# EAGLE design Dimmer_RevA (EAGLE 7.4.0)
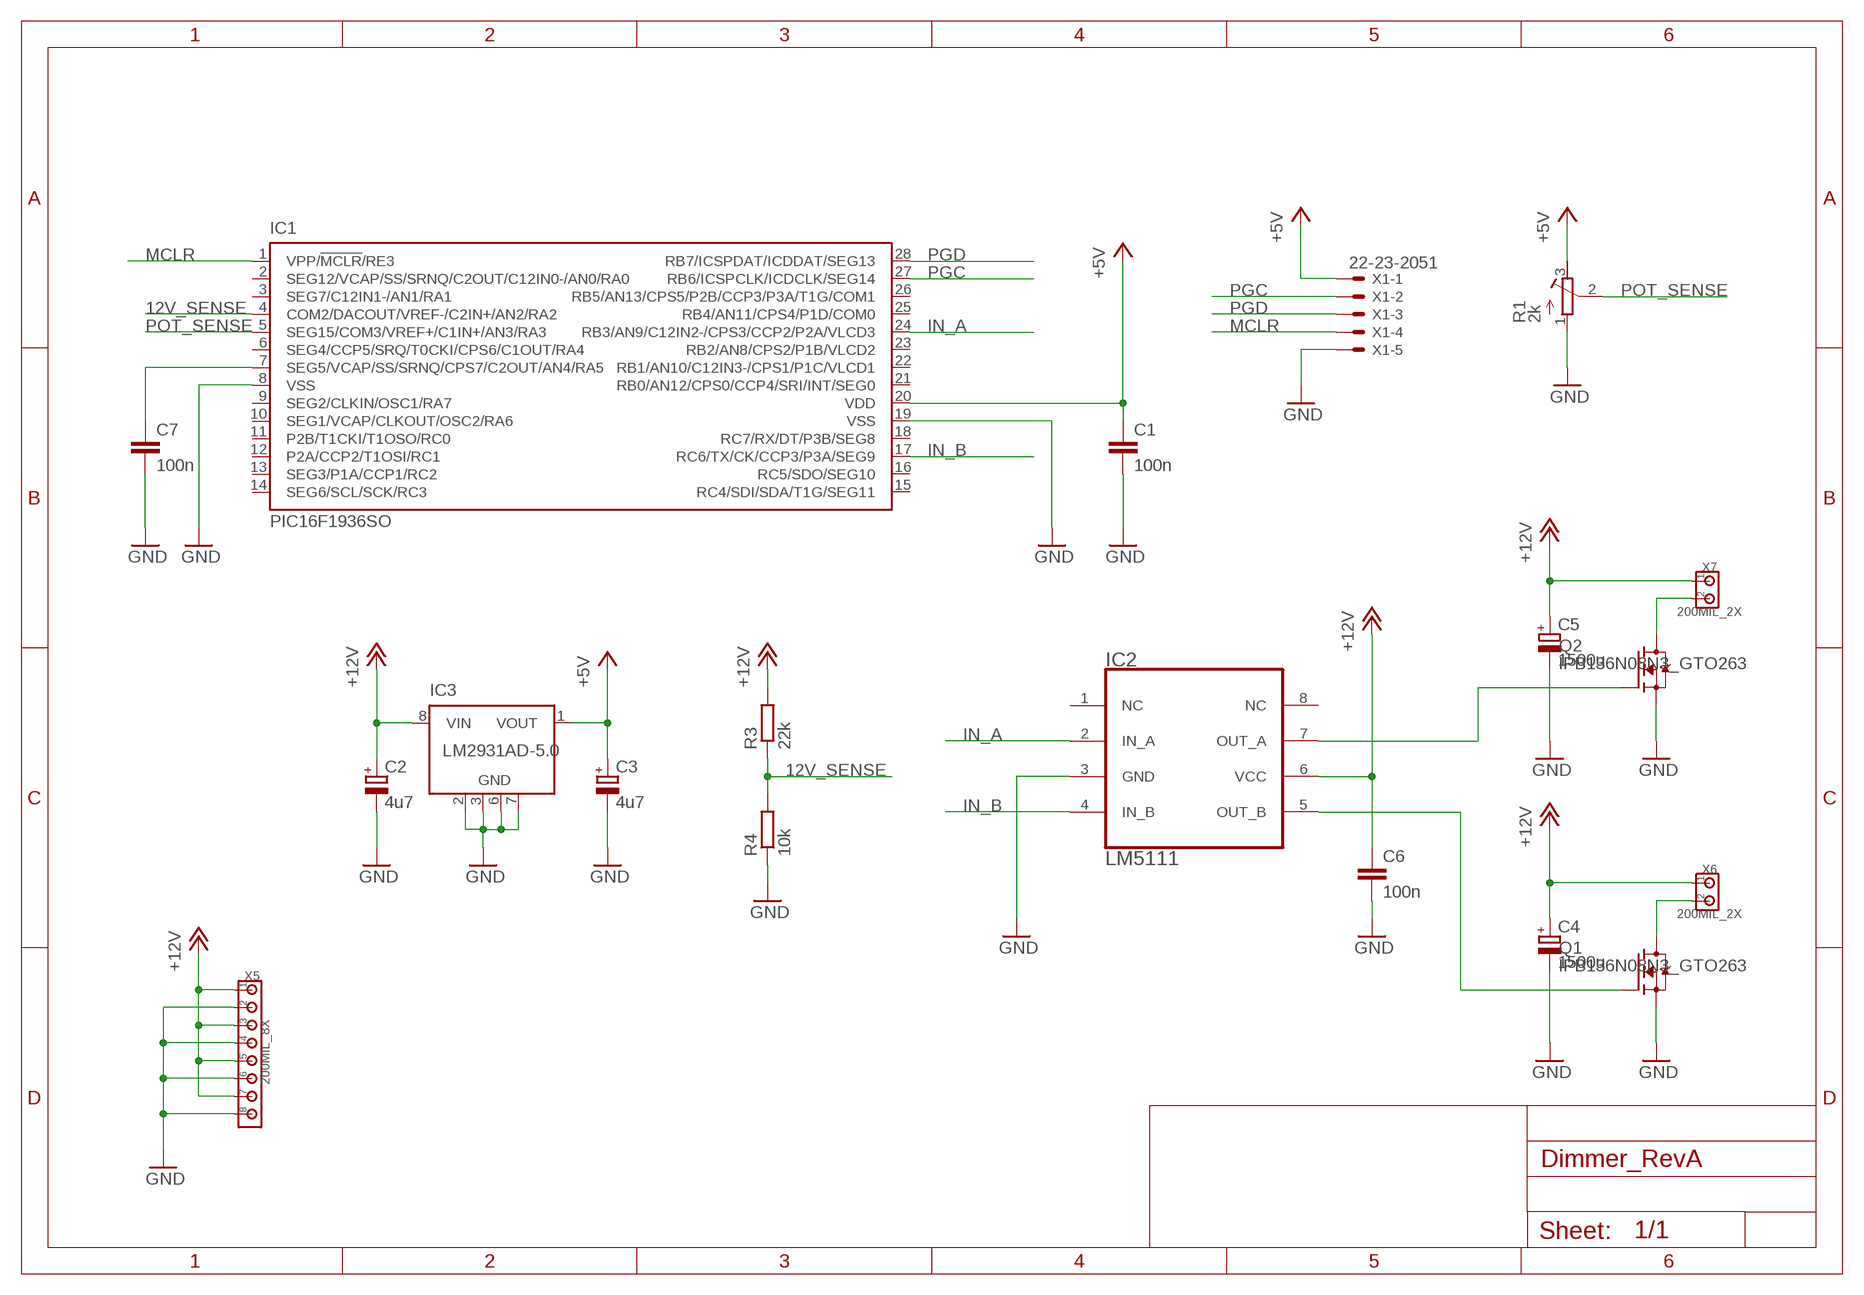
[diagram p0: schematic, sheet 1]

## Parts
C1  100n  CC0805  [C0805]
C2  4u7  C_POLARIZEDSMC_C  [SMC_C]
C3  4u7  C_POLARIZEDSMC_C  [SMC_C]
C4  1500u  C_POLARIZED10MM  [10MM]
C5  1500u  C_POLARIZED10MM  [10MM]
C6  100n  CC0805  [C0805]
C7  100n  CC0805  [C0805]
IC1  PIC16F1936SO  [SO28W]
IC2  LM5111  [SOIC8]
IC3  LM2931AD-5.0  [SO8]
Q1  IPB136N08N3_GTO263  [TO263-3]
Q2  IPB136N08N3_GTO263  [TO263-3]
R1  2k  TRIMMER  [CONTELEC]
R3  22k  RESISTORR0805  [R0805]
R4  10k  RESISTORR0805  [R0805]
X1  22-23-2051  [22-23-2051]
X5  200MIL_8X  [200MIL_8X]
X6  200MIL_2X  [200MIL_2X]
X7  200MIL_2X  [200MIL_2X]

## Nets
12V_SENSE: IC1.4(COM2/DACOUT/VREF-/C2IN+/AN2/RA2) R3.1 R4.2
+5V: C1.1 C3.+ IC1.20(VDD) IC3.1(VOUT) R1.3(CW) X1.1
+12V: C2.+ C4.+ C5.+ C6.1 IC2.6(VCC) IC3.8(VIN) R3.2 X5.1 X5.3 X5.5 X5.7 X6.1 X7.1
GND: C1.2 C2.- C3.- C4.- C5.- C6.2 C7.2 IC1.8(VSS) IC1.19(VSS) IC2.3(GND) IC3.2(GND) IC3.3(GND) IC3.6(GND) IC3.7(GND) Q1.3(S) Q2.3(S) R1.1(CCW) R4.1 X1.5 X5.2 X5.4 X5.6 X5.8
IN_A: IC1.24(RB3/AN9/C12IN2-/CPS3/CCP2/P2A/VLCD3) IC2.2(IN_A)
IN_B: IC1.17(RC6/TX/CK/CCP3/P3A/SEG9) IC2.4(IN_B)
MCLR: IC1.1(VPP/!MCLR!/RE3) X1.4
N$1: IC2.5(OUT_B) Q1.1(G)
N$2: Q1.TAB(D) X6.2
N$4: Q2.TAB(D) X7.2
N$5: C7.1 IC1.7(SEG5/VCAP/SS/SRNQ/CPS7/C2OUT/AN4/RA5)
N$6: IC2.7(OUT_A) Q2.1(G)
PGC: IC1.27(RB6/ICSPCLK/ICDCLK/SEG14) X1.2
PGD: IC1.28(RB7/ICSPDAT/ICDDAT/SEG13) X1.3
POT_SENSE: IC1.5(SEG15/COM3/VREF+/C1IN+/AN3/RA3) R1.2(WIPER)
Unconnected: IC1.2(SEG12/VCAP/SS/SRNQ/C2OUT/C12IN0-/AN0/RA0) IC1.3(SEG7/C12IN1-/AN1/RA1) IC1.6(SEG4/CCP5/SRQ/T0CKI/CPS6/C1OUT/RA4) IC1.9(SEG2/CLKIN/OSC1/RA7) IC1.10(SEG1/VCAP/CLKOUT/OSC2/RA6) IC1.11(P2B/T1CKI/T1OSO/RC0) IC1.12(P2A/CCP2/T1OSI/RC1) IC1.13(SEG3/P1A/CCP1/RC2) IC1.14(SEG6/SCL/SCK/RC3) IC1.15(RC4/SDI/SDA/T1G/SEG11) IC1.16(RC5/SDO/SEG10) IC1.18(RC7/RX/DT/P3B/SEG8) IC1.21(RB0/AN12/CPS0/CCP4/SRI/INT/SEG0) IC1.22(RB1/AN10/C12IN3-/CPS1/P1C/VLCD1) IC1.23(RB2/AN8/CPS2/P1B/VLCD2) IC1.25(RB4/AN11/CPS4/P1D/COM0) IC1.26(RB5/AN13/CPS5/P2B/CCP3/P3A/T1G/COM1) IC2.1(NC)

## Power pins joined to a net without a drawn wire
NC: IC2.8(NC)

## Library data of the parts
C1 C6 C7 = 00Capacitor:C: Capacitor
C2-C5 = 00Capacitor:C_POLARIZED
IC1 = 00PIC:PIC16F19*: Flash-Based, 8-Bit CMOS Microcontroller; EEPROM: 256; FLASH: 8192; RAM: 512
IC2 = 00Logic:LM5111
IC3 = 00VoltageRegulator:LM2931*
Q1 Q2 = 00Mosfet:IPB136N08N3_G
R1 = 00Resistor:TRIMMER
R3 R4 = 00Resistor:RESISTOR: RESISTOR, European symbol
X1 = 00Connector:22-23-2051: .100" (2.54mm) Center Header - 5 Pin; MF: MOLEX; MPN: 22-23-2051; OC_FARNELL: 1462952; OC_NEWARK: 38C9178
X5 = 00Connector:200MIL_8X
X6 X7 = 00Connector:200MIL_2X

## Board
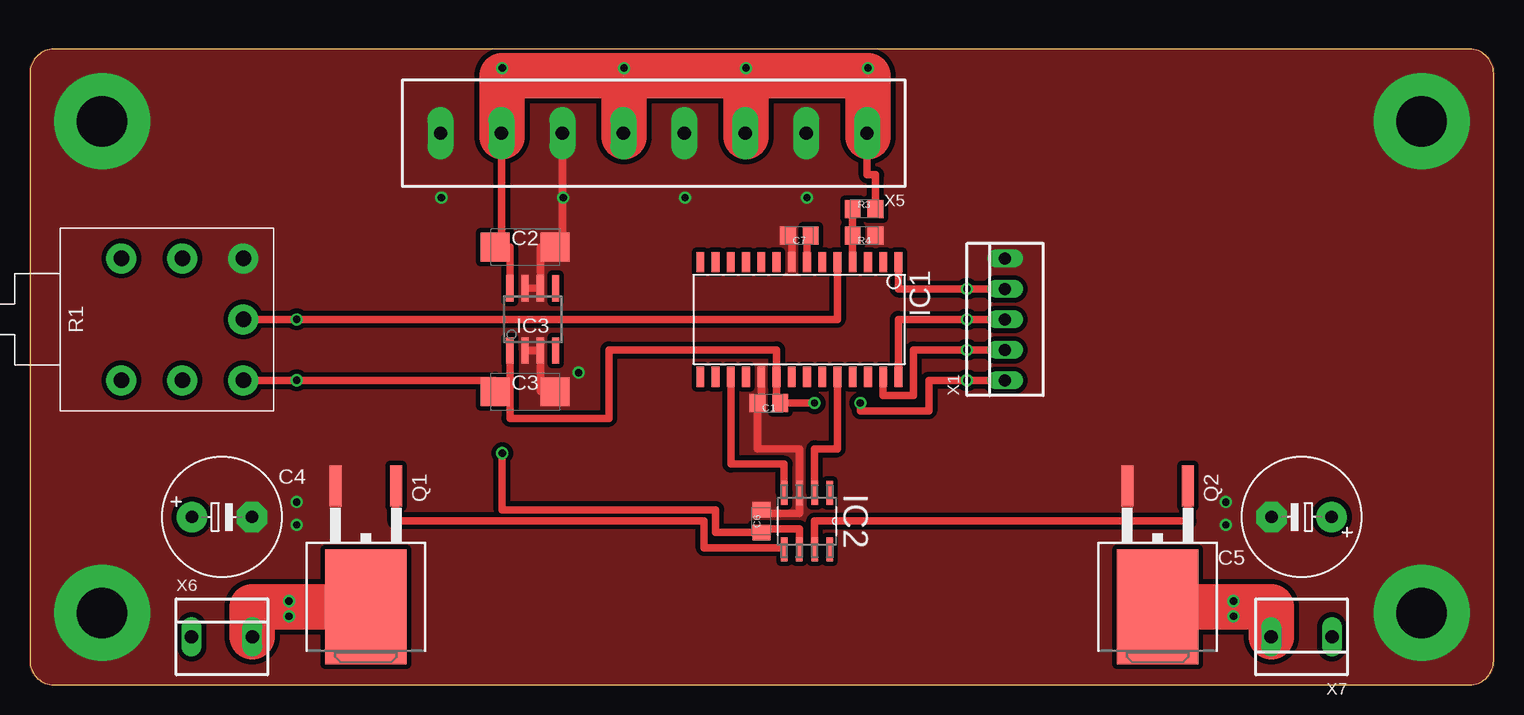
[diagram p1: board, top side]
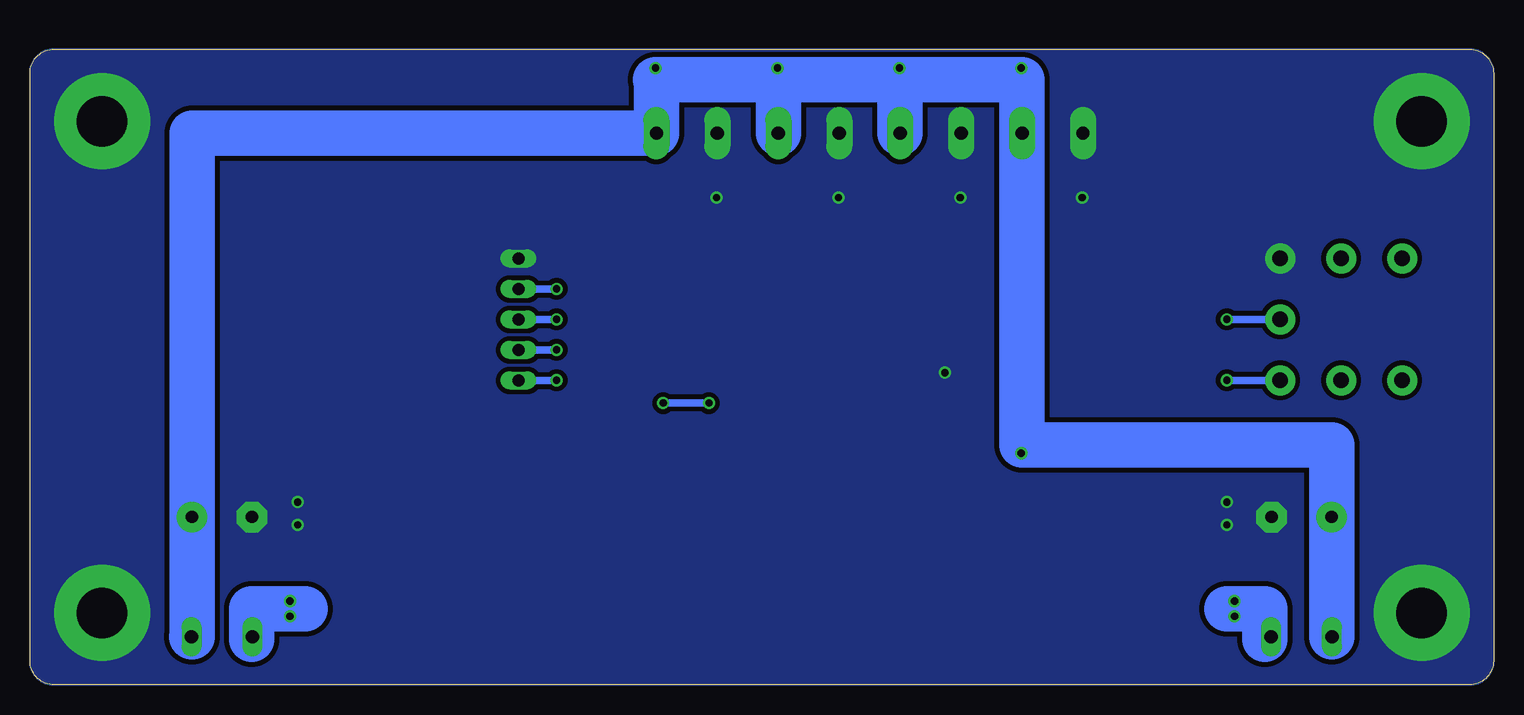
[diagram p2: board, bottom side, seen from below]

Size 122 x 53 mm. Coordinates in mm from the lower left corner, seen from the top.
Outline: 0,2 arc90 2,0 120,0 arc90 122,2 122,51 arc90 120,53 2,53 arc90 0,51 0,2
Copper layers (1*16): Top 0.035mm / dielectric 1.5mm / Bottom 0.035mm
Design rules "default *": minimum track width 10mil, minimum drill 24mil, track to track 8mil, track to pad 8mil, pad to pad 8mil, via to via 8mil, smd to smd 8mil, copper to edge 0mil, drill to drill 8mil, minimum pad ring 10mil, minimum via ring 8mil, stop-mask expansion 4mil, vias tented up to drill 0mil, thermal gap 10mil

### Footprints (pad centres in the part's own frame; a part is rotated, then mirrored left to right if it is on the bottom)
C0805 = smd 1.3 x 1.5: 1 -0.95,0; 2 0.95,0
SMC_C = smd 2.4 x 2.4: + -2.5,0; - 2.5,0
10MM = drill 1.016 pad 2.54: + -2.5,0 | drill 1.016 pad 2.54 octagon: - 2.5,0
SO28W = smd 0.65 x 1.7: 1 -7.62,-4.78; 2 -6.35,-4.78; 3 -5.08,-4.78; 4 -3.81,-4.78; 5 -2.54,-4.78; 6 -1.27,-4.78; 7 0,-4.78; 8 1.27,-4.78; 9 2.54,-4.78; 10 3.81,-4.78; 11 5.08,-4.78; 12 6.35,-4.78; 13 7.62,-4.78; 14 8.89,-4.78; 15 8.89,4.78; 16 7.62,4.78; 17 6.35,4.78; 18 5.08,4.78; 19 3.81,4.78; 20 2.54,4.78; 21 1.27,4.78; 22 0,4.78; 23 -1.27,4.78; 24 -2.54,4.78; 25 -3.81,4.78; 26 -5.08,4.78; 27 -6.35,4.78; 28 -7.62,4.78
SOIC8 = smd 1.981 x 0.559: 1 -2.362,1.905; 2 -2.362,0.635; 3 -2.362,-0.635; 4 -2.362,-1.905; 5 2.362,-1.905; 6 2.362,-0.635; 7 2.362,0.635; 8 2.362,1.905
SO8 = smd 2.2 x 0.6: 1 -2.6,1.905; 2 -2.6,0.635; 3 -2.6,-0.635; 4 -2.6,-1.905; 5 2.6,-1.905; 6 2.6,-0.635; 7 2.6,0.635; 8 2.6,1.905
TO263-3 = smd 1 x 3.4: 1 -2.54,-6.6; 3 2.54,-6.6 | smd 6.8 x 9.6: TAB 0,3.5
CONTELEC = drill 1.3 pad 2.5: 1 -5.08,5.08; 2 0,5.08; 3 5.08,5.08; 4 -5.08,0; 5 -5.08,-5.08; 6 5.08,-5.08; 7 5.08,0
R0805 = smd 1.3 x 1.5: 1 -0.95,0; 2 0.95,0
22-23-2051 = drill 1 long: 1 -5.08,0; 2 -2.54,0; 3 0,0; 4 2.54,0; 5 5.08,0
200MIL_8X = drill 1.1 pad 2.184 long: 1 -17.78,0; 2 -12.7,0; 3 -7.62,0; 4 -2.54,0; 5 2.54,0; 6 7.62,0; 7 12.7,0; 8 17.78,0
200MIL_2X = drill 1.1 long: 1 -2.54,0; 2 2.54,0

### Placement (x,y rotation side)
C1  61.59,23.5 180 top
C2  41.27,36.51 0 top
C3  41.27,24.45 0 top
C4  16,14 0 top
C5  106,14 180 top
C6  60.96,13.65 90 top
C7  64.14,37.47 180 top
IC1  64.77,30.48 180 top
IC2  64.77,13.65 270 top
IC3  41.91,30.48 90 top
Q1  28,10 180 top
Q2  94,10 180 top
R1  12.7,30.48 270 top
R3  69.53,39.69 0 top
R4  69.53,37.47 180 top
X1  81.28,30.48 90 top
X5  52,46 180 top
X6  16,4 0 top
X7  106,4 180 top

### Tracks (layer width: path | path; a pad name or v marks a point on that pad's centre or on a via)
12V_SENSE
  Top 0.61: IC1.4 R4.2 R3.1
+5V  (via drill 0.6)
  Top 0.61: IC3.1 40.01,24.45 | 40.01,24.45 C3.+ 38.77,25.4 v22.23,25.4 R1.3 | 40.01,24.45 40.01,22.23 48.26,22.23 48.26,27.94 62.23,27.94 IC1.20 62.23,23.5 C1.1 v65.41,23.5 | X1.1 v78.11,25.4 74.93,25.4 74.93,22.86 69.22,22.86 v69.22,23.5
  Bottom 0.61: v65.41,23.5 v69.22,23.5 | X1.1 v78.11,25.4
+12V  (via drill 0.6)
  Top 0.61: R3.2 70.48,42.55 69.78,42.55 X5.1 | IC2.6 64.14,13.02 61.27,13.02 arc90 C6.1 57.15,12.7 57.15,14.61 39.37,14.61 v39.37,19.32 | IC3.8 40.01,36.51 C2.+ 39.3,36.51 X5.7
  Bottom 0.406: v39.37,51.44 39.3,51.44 39.3,50.48 | v49.53,51.44 49.53,50.48 | v59.69,51.44 59.69,50.48 | v69.85,51.44 69.78,51.44 69.78,50.48
  Bottom 0.61: v39.37,19.32 39.3,20.32
  Bottom 3.81: X7.1 108.5,4 C5.+ 108.5,46 X5.1 69.78,50.48 | X6.1 13.5,4 C4.+ 13.5,20 39.3,20 39.3,20.32 X5.7 39.3,50.48 49.53,50.48 | 69.78,50.48 69.85,50.48 | 69.78,50.48 59.69,50.48 | 59.69,50.48 49.53,50.48 | X5.5 49.46,50.41 arc-90 49.53,50.48 | X5.3 59.62,50.41 arc-90 59.69,50.48
GND  (via drill 0.6, 4.2 pad 8)
  Top 0.61: IC1.8 63.5,37.47 C7.2 | IC1.19 60.96,23.38 C1.2 60.64,19.68 64.14,19.68 IC2.3 64.14,14.29 61.27,14.29 arc-90 C6.2 | IC3.7 IC3.6 42.55,36.51 C2.- 44.38,36.51 X5.6 | IC3.2 IC3.3 42.55,24.45 C3.-
  other vias: 6,47 6,6 116,47 116,6 34.29,40.64 44.45,40.64 54.61,40.64 64.77,40.64 22.23,13.34 99.69,13.34 22.23,15.24 99.69,15.24 45.72,26.04
  pour Bottom (isolate 0.4, no thermals): 0,19 0,51 arc-90 2,53 28,53 120,53 arc-90 122,51 122,31 122,2 arc-90 120,0 68,0 2,0 arc-90 0,2
  pour Top (isolate 0.4, no thermals): 28,53 120,53 arc-90 122,51 122,31 122,2 arc-90 120,0 78,0 2,0 arc-90 0,2 0,42 0,51 arc-90 2,53
IN_A
  Top 0.61: IC2.2 65.41,19.68 67.31,19.68 IC1.24
IN_B
  Top 0.61: IC2.4 62.87,18.41 58.42,18.41 IC1.17
MCLR  (via drill 0.6)
  Top 0.61: IC1.1 72.39,33.02 v78.11,33.02 X1.4
  Bottom 0.61: X1.4 v78.11,33.02
N$1
  Top 0.61: IC2.5 62.87,11.43 56.2,11.43 56.2,13.65 30.48,13.65 30.48,16.51 30.54,16.51 Q1.1
N$2  (via drill 0.6)
  Top 0.61: 18.54,6.5 21.59,6.5 v21.59,6.99
  Top 3.81: Q1.TAB 18.54,6.5 X6.2
  Bottom 0.61: v21.59,5.71 21.59,6.5 v21.59,6.99
N$3
  Bottom 0.61: 17.78,30.48 22.23,30.48
N$4  (via drill 0.6)
  Top 0.61: v100.33,5.71 v100.33,6.99 101.6,6.99 101.6,6.5
  Top 3.81: Q2.TAB 101.6,6.5 103.46,6.5 X7.2
N$5
  Top 0.61: IC1.7 64.77,37.47 C7.1
N$6
  Top 0.61: IC2.7 65.41,13.65 96.54,13.65 Q2.1
N$7
  Bottom 0.61: 17.78,25.4 22.23,25.4
N$8
  Top 3.81: 39.37,45.72 39.37,50.8 49.53,50.8 | 49.53,50.8 59.69,50.8 | 59.69,50.8 69.85,50.8 69.85,45.72 | 49.53,50.8 49.53,45.72 | 59.69,50.8 59.69,45.72
N$9
  Bottom 3.81: 19.05,3.81 19.05,6.35 22.23,6.35
N$10
  Bottom 3.81: 103.5,3.81 103.5,6.35 99.06,6.35
PGC  (via drill 0.6)
  Top 0.61: IC1.27 71.12,24.13 73.66,24.13 73.66,27.94 v78.11,27.94 X1.2
  Bottom 0.61: X1.2 v78.11,27.94
PGD  (via drill 0.6)
  Top 0.61: IC1.28 72.39,30.48 v78.11,30.48 X1.3
  Bottom 0.61: X1.3 v78.11,30.48
POT_SENSE  (via drill 0.6)
  Top 0.61: IC1.5 67.31,30.48 v22.23,30.48 R1.2

### Text on the board
tText: Lukas Fässler 2015